# EAGLE design OMAPProc (EAGLE 6.2)
AUTHOR: Ryan Julian (ryanjulian@berkeley.edu); DESIGN_NAME: OMAPProc; REVISION: B; YEAR: 2012

## Sheet 1 of 3: Torpedo SOM
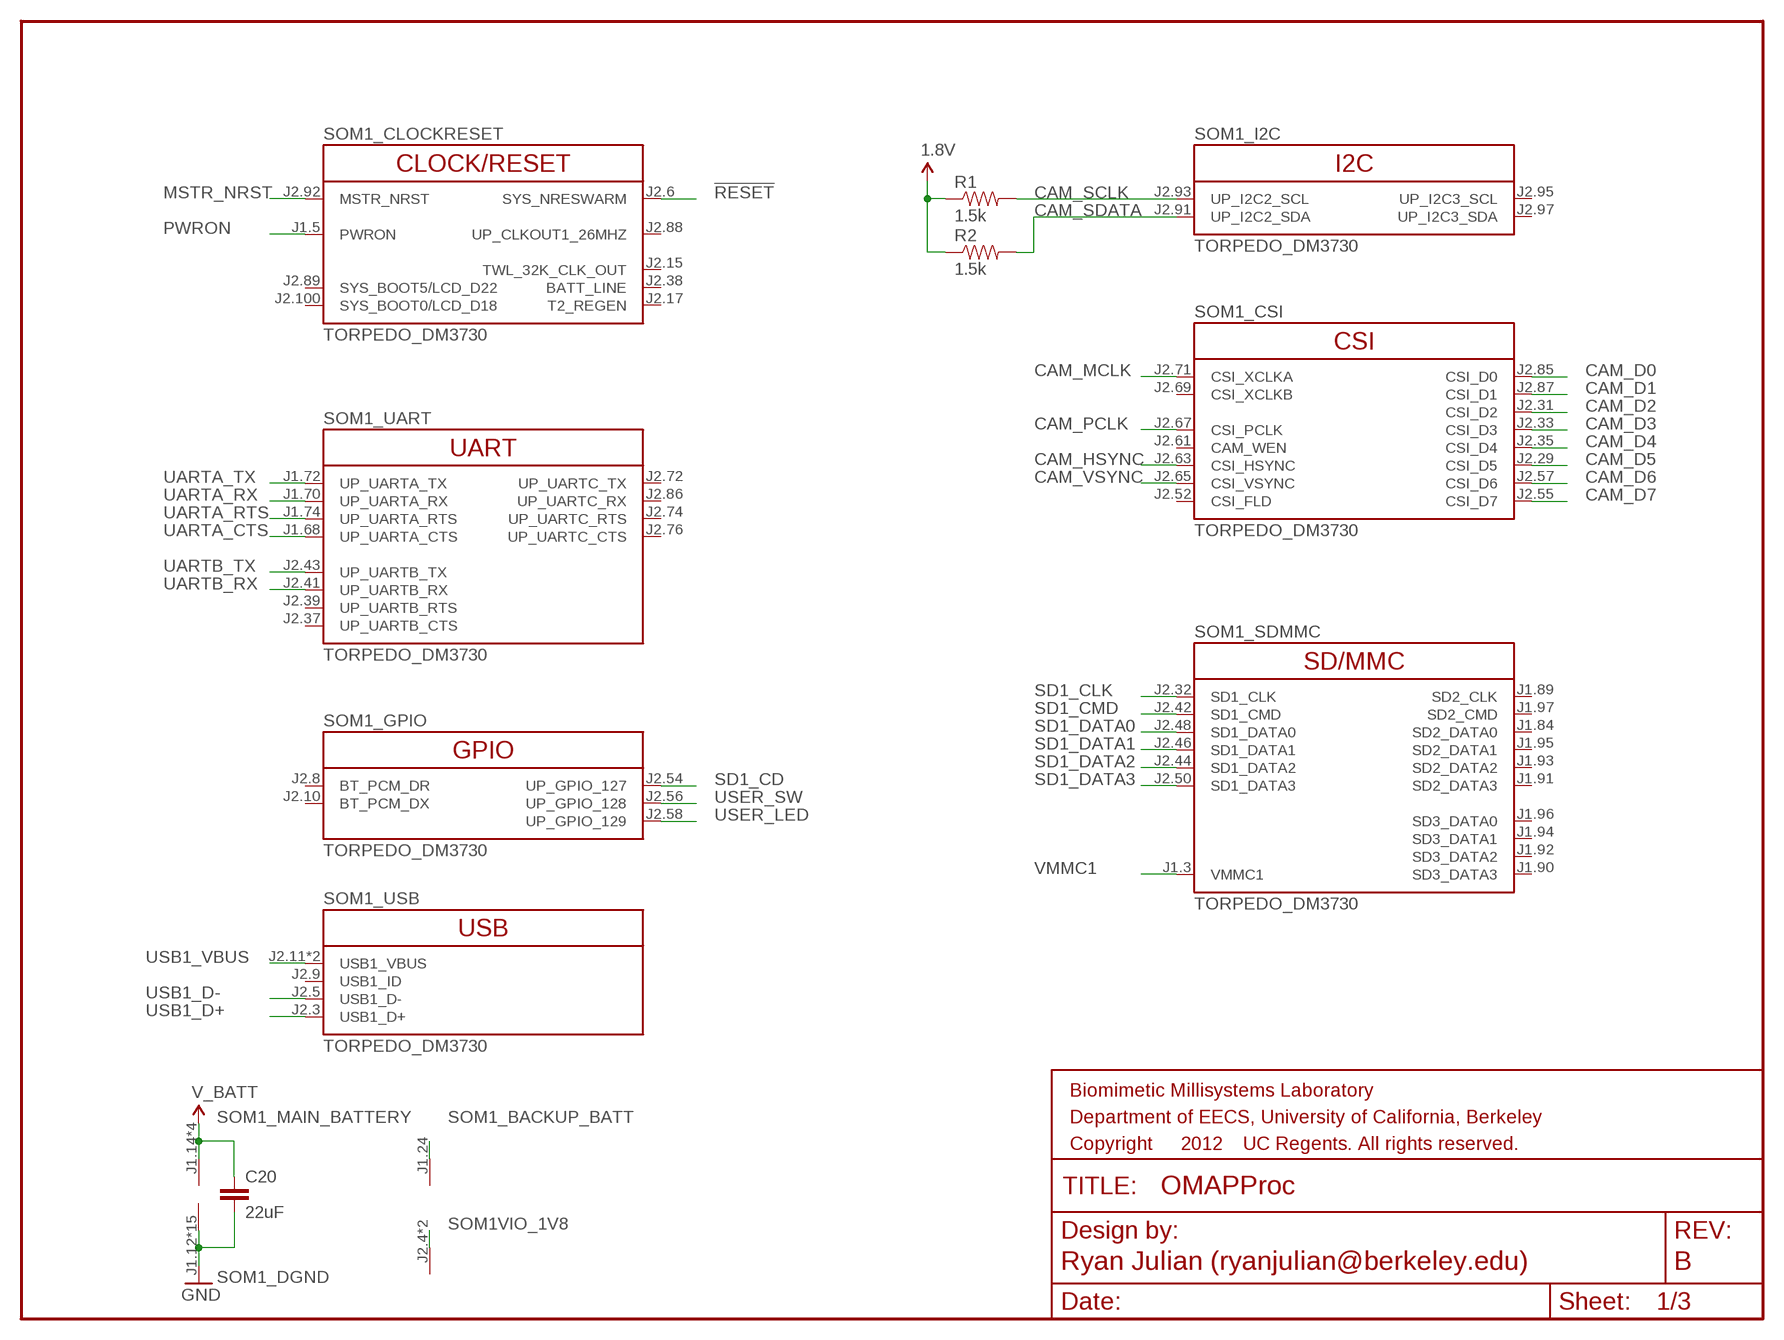
[diagram p0: schematic, sheet 1]
FRAME1 (FRAME-LETTER): SHEET_NAME: Torpedo SOM

### Parts
C20  22uF  CAP0603-CAP  [0603-CAP]
R1  1.5k  RESISTOR0402-RES  [0402-RES]
R2  1.5k  RESISTOR0402-RES  [0402-RES]
SOM1  TORPEDO_DM3730  [TORPEDO_DM3730]

### Nets
1.8V: R1.1 R2.1 ; also sheet 2,3
!RESET: SOM1.J2.6(_CLOCKRESET:SYS_NRESWARM) ; also sheet 2
CAM_D0: SOM1.J2.85(_CSI:CSI_D0) ; also sheet 2
CAM_D1: SOM1.J2.87(_CSI:CSI_D1) ; also sheet 2
CAM_D2: SOM1.J2.31(_CSI:CSI_D2) ; also sheet 2
CAM_D3: SOM1.J2.33(_CSI:CSI_D3) ; also sheet 2
CAM_D4: SOM1.J2.35(_CSI:CSI_D4) ; also sheet 2
CAM_D5: SOM1.J2.29(_CSI:CSI_D5) ; also sheet 2
CAM_D6: SOM1.J2.57(_CSI:CSI_D6) ; also sheet 2
CAM_D7: SOM1.J2.55(_CSI:CSI_D7) ; also sheet 2
CAM_HSYNC: SOM1.J2.63(_CSI:CSI_HSYNC) ; also sheet 2
CAM_MCLK: SOM1.J2.71(_CSI:CSI_XCLKA) ; also sheet 2
CAM_PCLK: SOM1.J2.67(_CSI:CSI_PCLK) ; also sheet 2
CAM_SCLK: R1.2 SOM1.J2.93(_I2C:UP_I2C2_SCL) ; also sheet 2
CAM_SDATA: R2.2 SOM1.J2.91(_I2C:UP_I2C2_SDA) ; also sheet 2
CAM_VSYNC: SOM1.J2.65(_CSI:CSI_VSYNC) ; also sheet 2
GND: C20.2 SOM1.J1.12(_DGND:V-) SOM1.J1.17(_DGND:V-) SOM1.J1.22(_DGND:V-) SOM1.J1.27(_DGND:V-) SOM1.J1.61(_DGND:V-) SOM1.J1.85(_DGND:V-) SOM1.J1.100(_DGND:V-) SOM1.J2.1(_DGND:V-) SOM1.J2.2(_DGND:V-) SOM1.J2.27(_DGND:V-) SOM1.J2.30(_DGND:V-) SOM1.J2.59(_DGND:V-) SOM1.J2.62(_DGND:V-) SOM1.J2.90(_DGND:V-) SOM1.J2.99(_DGND:V-) ; also sheet 2,3
MSTR_NRST: SOM1.J2.92(_CLOCKRESET:MSTR_NRST) ; also sheet 3
N$1: SOM1.J1.24(_BACKUP_BATT:V+)
N$2: SOM1.J2.4(VIO_1V8:V+) SOM1.J2.7(VIO_1V8:V+)
PWRON: SOM1.J1.5(_CLOCKRESET:PWRON) ; also sheet 3
SD1_CD: SOM1.J2.54(_GPIO:UP_GPIO_127) ; also sheet 3
SD1_CLK: SOM1.J2.32(_SDMMC:SD1_CLK) ; also sheet 3
SD1_CMD: SOM1.J2.42(_SDMMC:SD1_CMD) ; also sheet 3
SD1_DATA0: SOM1.J2.48(_SDMMC:SD1_DATA0) ; also sheet 3
SD1_DATA1: SOM1.J2.46(_SDMMC:SD1_DATA1) ; also sheet 3
SD1_DATA2: SOM1.J2.44(_SDMMC:SD1_DATA2) ; also sheet 3
SD1_DATA3: SOM1.J2.50(_SDMMC:SD1_DATA3) ; also sheet 3
UARTA_CTS: SOM1.J1.68(_UART:UP_UARTA_CTS) ; also sheet 3
UARTA_RTS: SOM1.J1.74(_UART:UP_UARTA_RTS) ; also sheet 3
UARTA_RX: SOM1.J1.70(_UART:UP_UARTA_RX) ; also sheet 3
UARTA_TX: SOM1.J1.72(_UART:UP_UARTA_TX) ; also sheet 3
UARTB_RX: SOM1.J2.41(_UART:UP_UARTB_RX) ; also sheet 3
UARTB_TX: SOM1.J2.43(_UART:UP_UARTB_TX) ; also sheet 3
USB1_D+: SOM1.J2.3(_USB:USB1_D+) ; also sheet 2
USB1_D-: SOM1.J2.5(_USB:USB1_D-) ; also sheet 2
USB1_VBUS: SOM1.J2.11(_USB:USB1_VBUS) SOM1.J2.13(_USB:USB1_VBUS) ; also sheet 2
USER_LED: SOM1.J2.58(_GPIO:UP_GPIO_129) ; also sheet 3
USER_SW: SOM1.J2.56(_GPIO:UP_GPIO_128) ; also sheet 3
V_BATT: C20.1 SOM1.J1.14(_MAIN_BATTERY:V+) SOM1.J1.16(_MAIN_BATTERY:V+) SOM1.J1.18(_MAIN_BATTERY:V+) SOM1.J1.20(_MAIN_BATTERY:V+) ; also sheet 3
VMMC1: SOM1.J1.3(_SDMMC:VMMC1) ; also sheet 3
Unconnected: SOM1.J1.1(_GPMC:UP_NWE) SOM1.J1.2(_AUDIO:CODEC_OUTL) SOM1.J1.4(_AUDIO:CODEC_INR) SOM1.J1.6(_AUDIO:CODEC_INL) SOM1.J1.7(_GPMC:UP_A9) SOM1.J1.8(_AUDIO:MIC_IN) SOM1.J1.9(_GPMC:UP_NCS0) SOM1.J1.10(_AUDIO:CODEC_OUTR) SOM1.J1.11(_GPMC:UP_NCS1) SOM1.J1.13(_GPMC:UP_A8) SOM1.J1.15(_GPMC:UP_NOE) SOM1.J1.19(_GPMC:UP_BUS_CLK) SOM1.J1.21(_GPMC:UP_NBE1) SOM1.J1.23(_GPMC:UP_NADV_ALE) SOM1.J1.25(_GPMC:UP_NBE0) SOM1.J1.26(_GPMC:UP_NWAIT) SOM1.J1.28(_GPMC:UP_NCS6) SOM1.J1.29(_GPMC:UP_D8) SOM1.J1.30(_GPMC:UP_DREQ0) SOM1.J1.31(_GPMC:UP_D9) SOM1.J1.32(_GPMC:UP_NCS5) SOM1.J1.33(_GPMC:UP_D2) SOM1.J1.34(_GPMC:UP_NCS4) SOM1.J1.35(_GPMC:UP_D0) SOM1.J1.36(_GPMC:UP_NCS3) SOM1.J1.37(_GPMC:UP_D1) SOM1.J1.38(_GPMC:UP_A10) SOM1.J1.39(_GPMC:UP_D3) SOM1.J1.40(_GPMC:UP_NCS2) SOM1.J1.41(_GPMC:UP_D12) SOM1.J1.42(_GPMC:UP_A4) SOM1.J1.43(_GPMC:UP_D10) SOM1.J1.44(_GPMC:UP_A3) SOM1.J1.45(_GPMC:UP_D11) SOM1.J1.46(_GPMC:UP_A2) SOM1.J1.47(_GPMC:UP_D13) SOM1.J1.48(_GPMC:UP_A1) SOM1.J1.49(_GPMC:UP_D4) SOM1.J1.50(_GPMC:UP_A7) SOM1.J1.51(_MCSPI:MCSPI2_CS1) SOM1.J1.52(_GPMC:UP_A6) SOM1.J1.53(_GPMC:UP_D6) SOM1.J1.54(_GPMC:UP_A5) SOM1.J1.55(_GPMC:UP_D7) SOM1.J1.56(_MCSPI:MCSPI2_SOMI) SOM1.J1.57(_GPMC:UP_D5) SOM1.J1.58(_MCSPI:MCSPI2_CS0) SOM1.J1.59(_GPMC:UP_D14) SOM1.J1.60(_MCSPI:MCSPI1_SOMI) SOM1.J1.62(_MCBSP:MCBSP4_DR) SOM1.J1.63(_GPMC:UP_D15) SOM1.J1.64(_MCSPI:MCSPI1_CLK) SOM1.J1.65(_MCSPI:MCSPI2_SIMO) SOM1.J1.66(_MCSPI:MCSPI1_SIMO) SOM1.J1.67(_MCSPI:MCSPI2_CLK) SOM1.J1.69(_MCSPI:MCSPI1_CS1) SOM1.J1.71(_MCSPI:MCSPI1_CS0) SOM1.J1.73(_LCDTV:LCD_PANEL_PWR) SOM1.J1.75(_LCDTV:LCD_BACKLIGHT_PWR) SOM1.J1.76(_ADC:ADCIN0) SOM1.J1.77(_MCBSP:MCBSP3_DR) SOM1.J1.78(_ADC:ADCIN1) SOM1.J1.79(_MCBSP:MCBSP3_DX) SOM1.J1.80(_ADC:ADCIN2) SOM1.J1.81(_MCBSP:MCBSP3_FSX) SOM1.J1.82(_ADC:ADCIN3) SOM1.J1.83(_MCBSP:MCBSP3_CLKX) SOM1.J1.84(_SDMMC:SD2_DATA0) SOM1.J1.86(_LCDTV:LCD_D17) SOM1.J1.87(_LCDTV:LCD_D23/SYS_BOOT6) SOM1.J1.88(_MCSPI:MCSPI3_CLK) SOM1.J1.89(_SDMMC:SD2_CLK) SOM1.J1.90(_SDMMC:SD3_DATA3) SOM1.J1.91(_SDMMC:SD2_DATA3) SOM1.J1.92(_SDMMC:SD3_DATA2) SOM1.J1.93(_SDMMC:SD2_DATA2) SOM1.J1.94(_SDMMC:SD3_DATA1) SOM1.J1.95(_SDMMC:SD2_DATA1) SOM1.J1.96(_SDMMC:SD3_DATA0) SOM1.J1.97(_SDMMC:SD2_CMD) SOM1.J1.98(_GPMC:UP_IODIR) SOM1.J1.99(_LCDTV:LCD_D16) SOM1.J2.8(_GPIO:BT_PCM_DR) SOM1.J2.9(_USB:USB1_ID) SOM1.J2.10(_GPIO:BT_PCM_DX) SOM1.J2.12(_LCDTV:LCD_HSYNC) SOM1.J2.14(_LCDTV:LCD_VSYNC) SOM1.J2.15(_CLOCKRESET:TWL_32K_CLK_OUT) SOM1.J2.16(_LCDTV:LCD_MDISP) SOM1.J2.17(_CLOCKRESET:T2_REGEN) SOM1.J2.18(_LCDTV:LCD_D6/G1) SOM1.J2.20(_LCDTV:LCD_D20/SYS_BOOT3) SOM1.J2.22(_LCDTV:LCD_D9/G4) SOM1.J2.24(_LCDTV:LCD_D8/G3) SOM1.J2.26(_LCDTV:LCD_D7/G2) SOM1.J2.28(_LCDTV:LCD_DCLK) SOM1.J2.34(_LCDTV:LCD_D19/SYS_BOOT1) SOM1.J2.36(_LCDTV:LCD_D18/SYS_BOOT0) SOM1.J2.37(_UART:UP_UARTB_CTS) SOM1.J2.38(_CLOCKRESET:BATT_LINE) SOM1.J2.39(_UART:UP_UARTB_RTS) SOM1.J2.40(_LCDTV:LCD_D21/SYS_BOOT4) SOM1.J2.45(_MCSPI:MCSPI4_CS0) SOM1.J2.47(_MCBSP:MCBSP2_DX) SOM1.J2.49(_MCBSP:MCBSP2_CLKX) SOM1.J2.51(_MCBSP:MCBSP2_FSX) SOM1.J2.52(_CSI:CSI_FLD) SOM1.J2.53(_MCBSP:MCBSP2_DR) SOM1.J2.60(_LCDTV:TV_OUT2) SOM1.J2.61(_CSI:CAM_WEN) SOM1.J2.64(_LCDTV:TV_OUT1) SOM1.J2.66(_LCDTV:LCD_D14/R4) SOM1.J2.68(_LCDTV:LCD_D13/R3) SOM1.J2.69(_CSI:CSI_XCLKB) SOM1.J2.70(_LCDTV:LCD_D12/R2) SOM1.J2.72(_UART:UP_UARTC_TX) SOM1.J2.73(_MCSPI:MCSPI4_SOMI) SOM1.J2.74(_UART:UP_UARTC_RTS) SOM1.J2.75(_MCSPI:MCSPI4_SIMO) SOM1.J2.76(_UART:UP_UARTC_CTS) SOM1.J2.77(_MCSPI:MCSPI4_CLK) SOM1.J2.78(_LCDTV:LCD_D15/R5) SOM1.J2.79(_LCDTV:LCD_D2/B3) SOM1.J2.80(_LCDTV:LCD_D22/SYS_BOOT5) SOM1.J2.81(_LCDTV:LCD_D3/B4) SOM1.J2.82(_LCDTV:LCD_D10/G5) SOM1.J2.83(_LCDTV:LCD_D1/B2) SOM1.J2.84(_LCDTV:LCD_D11/R1) SOM1.J2.86(_UART:UP_UARTC_RX) SOM1.J2.88(_CLOCKRESET:UP_CLKOUT1_26MHZ) SOM1.J2.89(_CLOCKRESET:SYS_BOOT5/LCD_D22) SOM1.J2.94(_LCDTV:LCD_D4/B5) SOM1.J2.95(_I2C:UP_I2C3_SCL) SOM1.J2.96(_LCDTV:LCD_D5/G0) SOM1.J2.97(_I2C:UP_I2C3_SDA) SOM1.J2.98(_LCDTV:LCD_D0/B1) SOM1.J2.100(_CLOCKRESET:SYS_BOOT0/LCD_D18)

## Sheet 2 of 3: Cameras
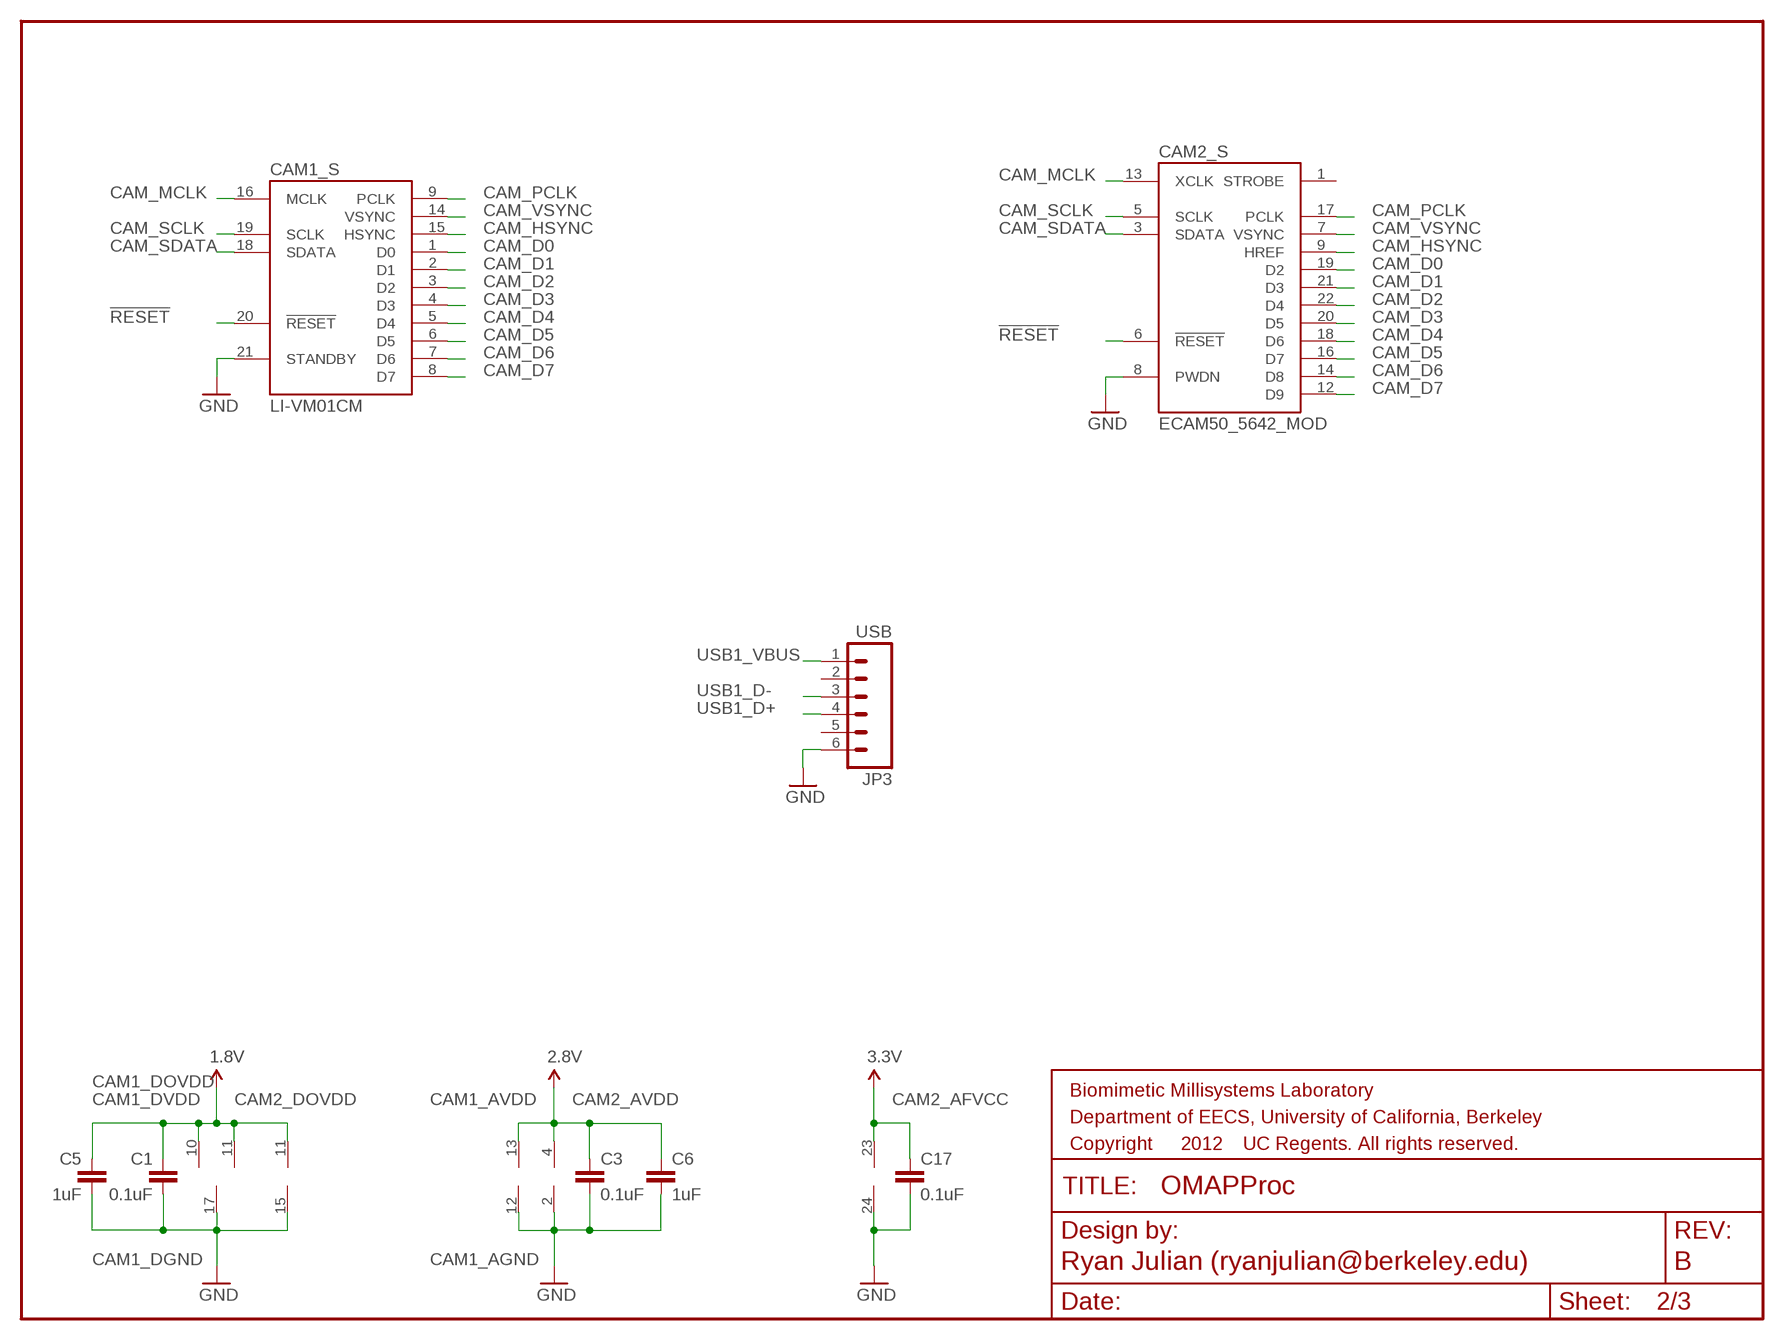
[diagram p1: schematic, sheet 2]
FRAME2 (FRAME-LETTER): SHEET_NAME: Cameras

### Parts
C1  0.1uF  CAP0402-CAP  [0402-CAP]
C3  0.1uF  CAP0402-CAP  [0402-CAP]
C5  1uF  CAP0402-CAP  [0402-CAP]
C6  1uF  CAP0402-CAP  [0402-CAP]
C17  0.1uF  CAP0402-CAP  [0402-CAP]
CAM1  LI-VM01CM  [AXK7L28227G]
CAM2  ECAM50_5642_MOD  [XF2W-2415-1A]
JP3  USB  MOLEX_503480-0600  [MOLEX_503480-0600]

### Nets
1.8V: C1.2 C5.2 CAM1.10(_DVDD:V+) CAM1.11(_DOVDD:V+) CAM2.11(_DOVDD:V+) ; also sheet 1,3
2.8V: C3.1 C6.1 CAM1.13(_AVDD:V+) CAM2.4(_AVDD:V+) ; also sheet 3
3.3V: C17.1 CAM2.23(_AFVCC:V+) ; also sheet 3
!RESET: CAM1.20(_S:!RESET) CAM2.6(_S:!RESET) ; also sheet 1
CAM_D0: CAM1.1(_S:D0) CAM2.19(_S:D2) ; also sheet 1
CAM_D1: CAM1.2(_S:D1) CAM2.21(_S:D3) ; also sheet 1
CAM_D2: CAM1.3(_S:D2) CAM2.22(_S:D4) ; also sheet 1
CAM_D3: CAM1.4(_S:D3) CAM2.20(_S:D5) ; also sheet 1
CAM_D4: CAM1.5(_S:D4) CAM2.18(_S:D6) ; also sheet 1
CAM_D5: CAM1.6(_S:D5) CAM2.16(_S:D7) ; also sheet 1
CAM_D6: CAM1.7(_S:D6) CAM2.14(_S:D8) ; also sheet 1
CAM_D7: CAM1.8(_S:D7) CAM2.12(_S:D9) ; also sheet 1
CAM_HSYNC: CAM1.15(_S:HSYNC) CAM2.9(_S:HREF) ; also sheet 1
CAM_MCLK: CAM1.16(_S:MCLK) CAM2.13(_S:XCLK) ; also sheet 1
CAM_PCLK: CAM1.9(_S:PCLK) CAM2.17(_S:PCLK) ; also sheet 1
CAM_SCLK: CAM1.19(_S:SCLK) CAM2.5(_S:SCLK) ; also sheet 1
CAM_SDATA: CAM1.18(_S:SDATA) CAM2.3(_S:SDATA) ; also sheet 1
CAM_VSYNC: CAM1.14(_S:VSYNC) CAM2.7(_S:VSYNC) ; also sheet 1
GND: C1.1 C3.2 C5.1 C6.2 C17.2 CAM1.12(_AGND:V-) CAM1.17(_DGND:V-) CAM1.21(_S:STANDBY) CAM2.2(_AVDD:V-) CAM2.8(_S:PWDN) CAM2.15(_DOVDD:V-) CAM2.24(_AFVCC:V-) JP3.6 ; also sheet 1,3
USB1_D+: JP3.4 ; also sheet 1
USB1_D-: JP3.3 ; also sheet 1
USB1_VBUS: JP3.1 ; also sheet 1
Unconnected: CAM2.1(_S:STROBE) JP3.2 JP3.5

## Sheet 3 of 3: Connectors and Power
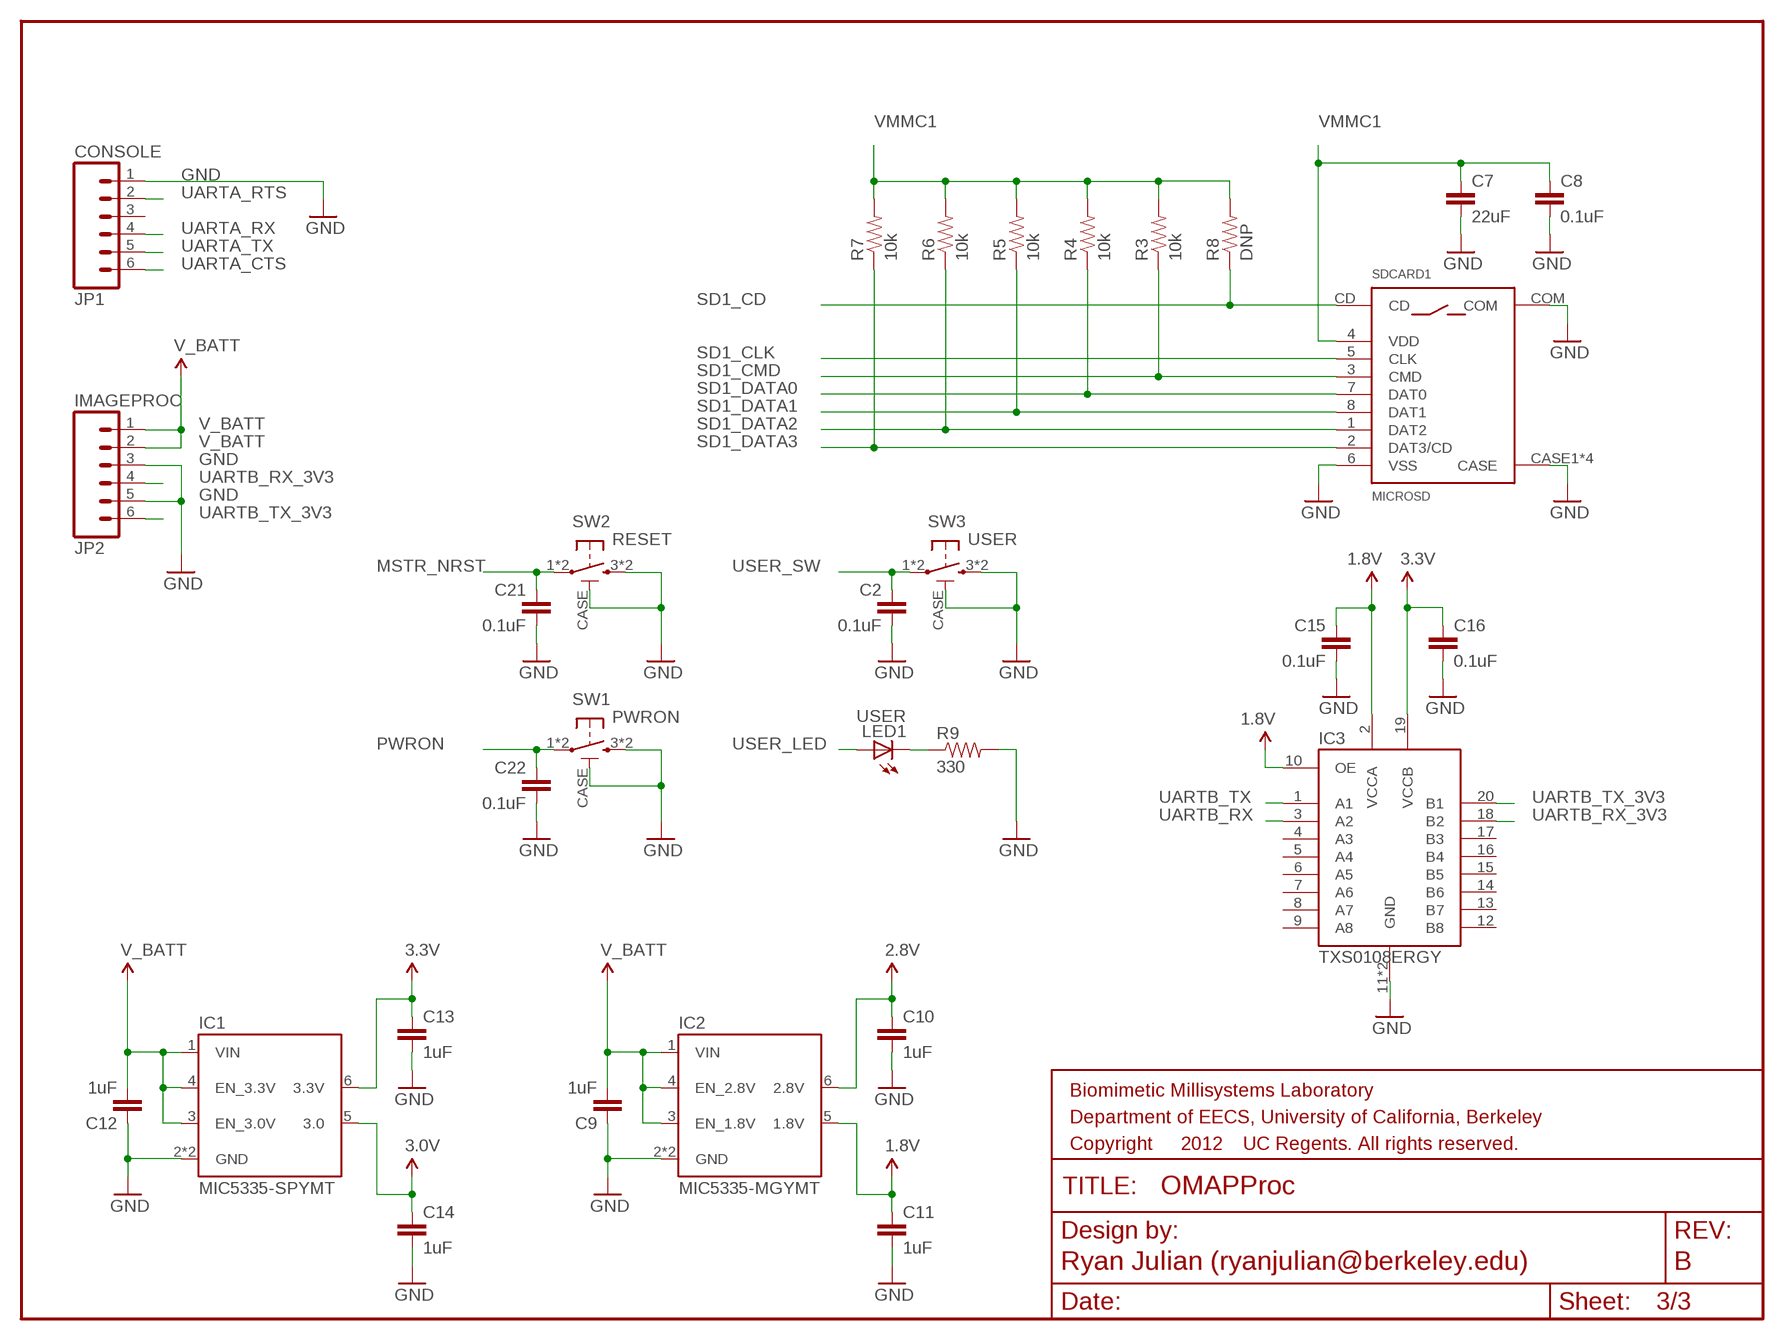
[diagram p2: schematic, sheet 3]
FRAME3 (FRAME-LETTER): SHEET_NAME: Connectors and Power

### Parts
C2  0.1uF  CAP0402-CAP  [0402-CAP]
C7  22uF  CAP0603-CAP  [0603-CAP]
C8  0.1uF  CAP0402-CAP  [0402-CAP]
C9  1uF  CAP0402-CAP  [0402-CAP]
C10  1uF  CAP0402-CAP  [0402-CAP]
C11  1uF  CAP0402-CAP  [0402-CAP]
C12  1uF  CAP0402-CAP  [0402-CAP]
C13  1uF  CAP0402-CAP  [0402-CAP]
C14  1uF  CAP0402-CAP  [0402-CAP]
C15  0.1uF  CAP0402-CAP  [0402-CAP]
C16  0.1uF  CAP0402-CAP  [0402-CAP]
C21  0.1uF  CAP0402-CAP  [0402-CAP]
C22  0.1uF  CAP0402-CAP  [0402-CAP]
IC1  MIC5335-SPYMT  [MLF-6]
IC2  MIC5335-MGYMT  [MLF-6]
IC3  TXS0108ERGY  [R-PVQFN-N20]
JP1  CONSOLE  MOLEX_503480-0600  [MOLEX_503480-0600]
JP2  IMAGEPROC  MOLEX_503480-0600  [MOLEX_503480-0600]
LED1  USER  LED0603  [LED-0603]
R3  10k  RESISTOR0402-RES  [0402-RES]
R4  10k  RESISTOR0402-RES  [0402-RES]
R5  10k  RESISTOR0402-RES  [0402-RES]
R6  10k  RESISTOR0402-RES  [0402-RES]
R7  10k  RESISTOR0402-RES  [0402-RES]
R8  DNP  RESISTOR0402-RES  [0402-RES]
R9  330  RESISTOR0402-RES  [0402-RES]
SDCARD1  MICROSD  [AVX_045138008010890+]
SW1  PWRON  KMR421GLFS  [KMR421G]
SW2  RESET  KMR421GLFS  [KMR421G]
SW3  USER  KMR421GLFS  [KMR421G]

### Nets
1.8V: C11.1 C15.1 IC2.5(1.8V) IC3.2(VCCA) IC3.10(OE) ; also sheet 1,2
2.8V: C10.1 IC2.6(2.8V) ; also sheet 2
3.0V: C14.1 IC1.5(3.0)
3.3V: C13.1 C16.1 IC1.6(3.3V) IC3.19(VCCB) ; also sheet 2
GND: C2.2 C7.2 C8.2 C9.1 C10.2 C11.2 C12.1 C13.2 C14.2 C15.2 C16.2 C21.2 C22.2 IC1.2(GND) IC1.EPAD(GND) IC2.2(GND) IC2.EPAD(GND) IC3.11(GND) IC3.EPAD(GND) JP1.1 JP2.3 JP2.5 R9.2 SDCARD1.6(VSS) SDCARD1.CASE1(CASE) SDCARD1.CASE2(CASE) SDCARD1.CASE3(CASE) SDCARD1.CASE4(CASE) SDCARD1.COM SW1.3(S) SW1.4(S) SW1.CASE SW2.3(S) SW2.4(S) SW2.CASE SW3.3(S) SW3.4(S) SW3.CASE ; also sheet 1,2
MSTR_NRST: C21.1 SW2.1(P) SW2.2(P) ; also sheet 1
N$3: LED1.C R9.1
PWRON: C22.1 SW1.1(P) SW1.2(P) ; also sheet 1
SD1_CD: R8.1 SDCARD1.CD ; also sheet 1
SD1_CLK: SDCARD1.5(CLK) ; also sheet 1
SD1_CMD: R3.1 SDCARD1.3(CMD) ; also sheet 1
SD1_DATA0: R4.1 SDCARD1.7(DAT0) ; also sheet 1
SD1_DATA1: R5.1 SDCARD1.8(DAT1) ; also sheet 1
SD1_DATA2: R6.1 SDCARD1.1(DAT2) ; also sheet 1
SD1_DATA3: R7.1 SDCARD1.2(DAT3/CD) ; also sheet 1
UARTA_CTS: JP1.6 ; also sheet 1
UARTA_RTS: JP1.2 ; also sheet 1
UARTA_RX: JP1.4 ; also sheet 1
UARTA_TX: JP1.5 ; also sheet 1
UARTB_RX: IC3.3(A2) ; also sheet 1
UARTB_RX_3V3: IC3.18(B2) JP2.4
UARTB_TX: IC3.1(A1) ; also sheet 1
UARTB_TX_3V3: IC3.20(B1) JP2.6
USER_LED: LED1.A ; also sheet 1
USER_SW: C2.1 SW3.1(P) SW3.2(P) ; also sheet 1
V_BATT: C9.2 C12.2 IC1.1(VIN) IC1.3(EN_3.0V) IC1.4(EN_3.3V) IC2.1(VIN) IC2.3(EN_1.8V) IC2.4(EN_2.8V) JP2.1 JP2.2 ; also sheet 1
VMMC1: C7.1 C8.1 R3.2 R4.2 R5.2 R6.2 R7.2 R8.2 SDCARD1.4(VDD) ; also sheet 1
Unconnected: IC3.4(A3) IC3.5(A4) IC3.6(A5) IC3.7(A6) IC3.8(A7) IC3.9(A8) IC3.12(B8) IC3.13(B7) IC3.14(B6) IC3.15(B5) IC3.16(B4) IC3.17(B3) JP1.3

## Library data of the parts
C1-C3 C5-C17 C20-C22 = biomimetic:CAP: Capacitor Standard 0603 ceramic capacitor, and 0.1" leaded capacitor.
CAM1 = biomimetic:LI-VM01CM: VGA camera module for OMAP Backpack Digi-Key P/N refers to the appropriate mating connector; DIGIKEY: 255-3150-1-ND
CAM2 = biomimetic:ECAM50_5642_MOD: e-con Systems 5MP AF camera module Digi-Key P/N is for the appropriate mating connector.; DIGIKEY: OR877CT-ND
IC1 = biomimetic:MIC5335-SPYMT: Micrel MIC5335 150mA dual (3.3V/3.0V) voltage regulator.; DIGIKEY: 576-1949-1-ND
IC2 = biomimetic:MIC5335-MGYMT: Micrel MIC5335 150mA dual (2.8V/1.8V) voltage regulator.; DIGIKEY: 576-3670-1-ND
IC3 = biomimetic:TXS0108E: 8-BIT BIDIRECTIONAL VOLTAGE-LEVEL TRANSLATOR FOR OPEN-DRAIN AND PUSH-PULL APPLICATIONS; DIGIKEY: 296-24806-1-ND
JP1-JP3 = biomimetic:MOLEX_503480-0600: Molex FPC connector, 6 pos.; DIGIKEY: WM1387CT-ND
LED1 = biomimetic:LED: LEDs Standard schematic elements and footprints for 5mm, 3mm, 1206, and 0603 sized LEDs. 5mm - Spark Fun Electronics SKU : COM-00529 (and others)
R1-R9 = biomimetic:RESISTOR: Resistor Basic schematic elements and footprints for 0603, 1206, and PTH resistors.
SDCARD1 = biomimetic:MICROSD: AVX 045138008010890+ microSD card connector; DIGIKEY: 478-4965-1-ND
SOM1 = biomimetic:TORPEDO_DM3730: LogicPD Torpeod DM3730 System-On-Module Mating connector HiRose DF40C-100DS-0.4V(51) Digi-Key P/N: H11615CT-ND; DIGIKEY: 460-3514-ND
SW1-SW3 = biomimetic:KMR421G: SWITCH TACTILE SPST-NO 0.05A 32V; DIGIKEY: CKN10249CT-ND

## Net classes
1 sup: width 0.254 mm

## Board
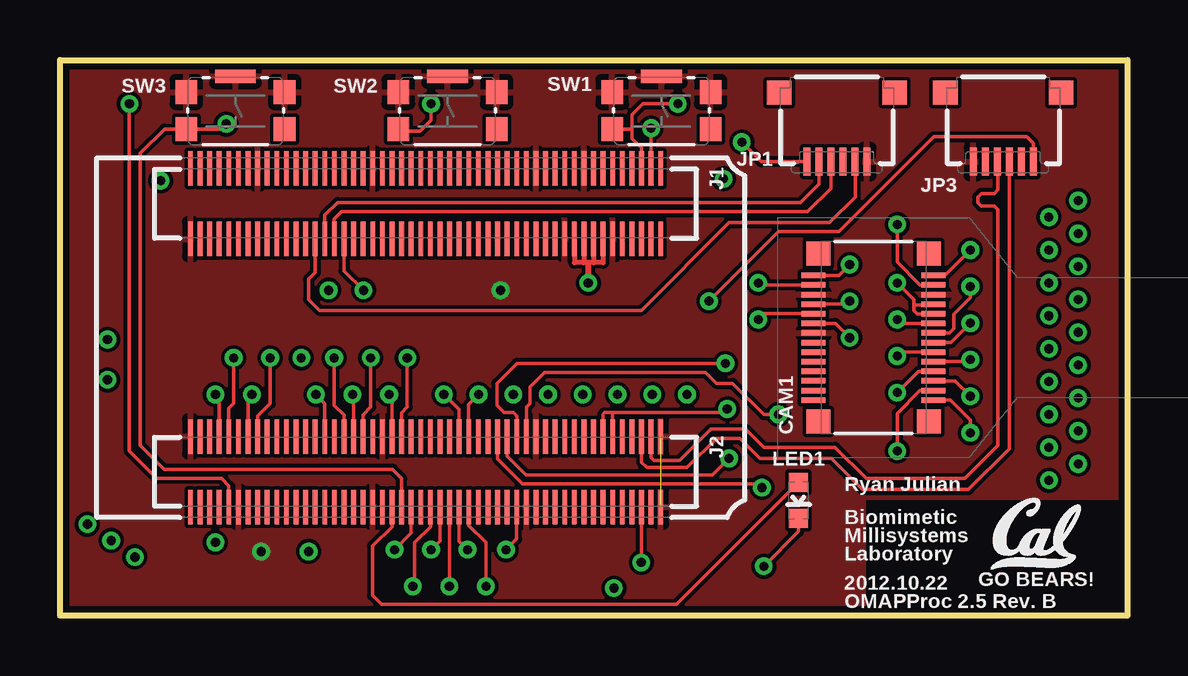
[diagram p3: board, top side]
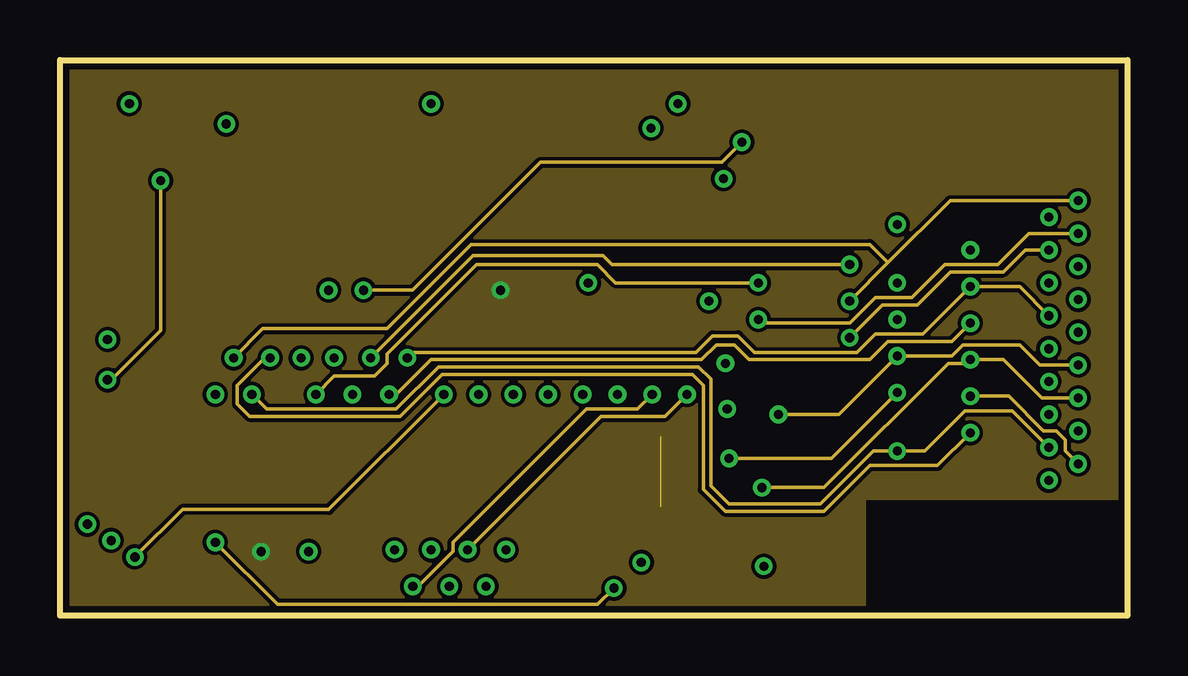
[diagram p4: board, inner layer Ground]
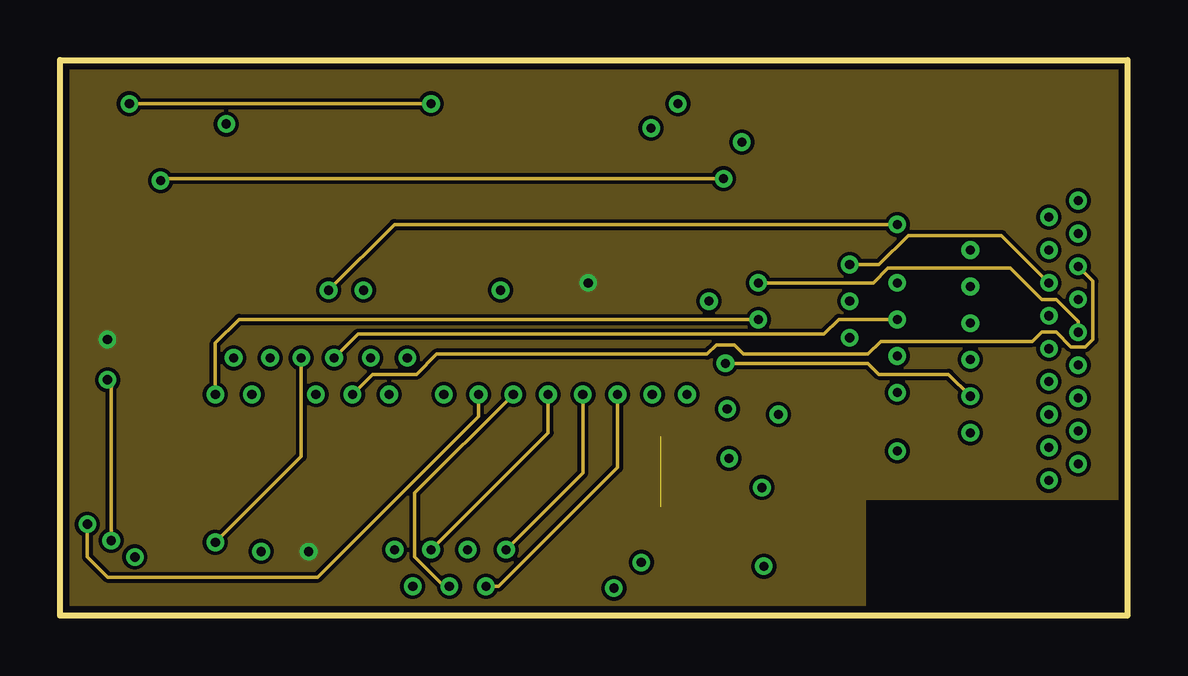
[diagram p5: board, inner layer Power]
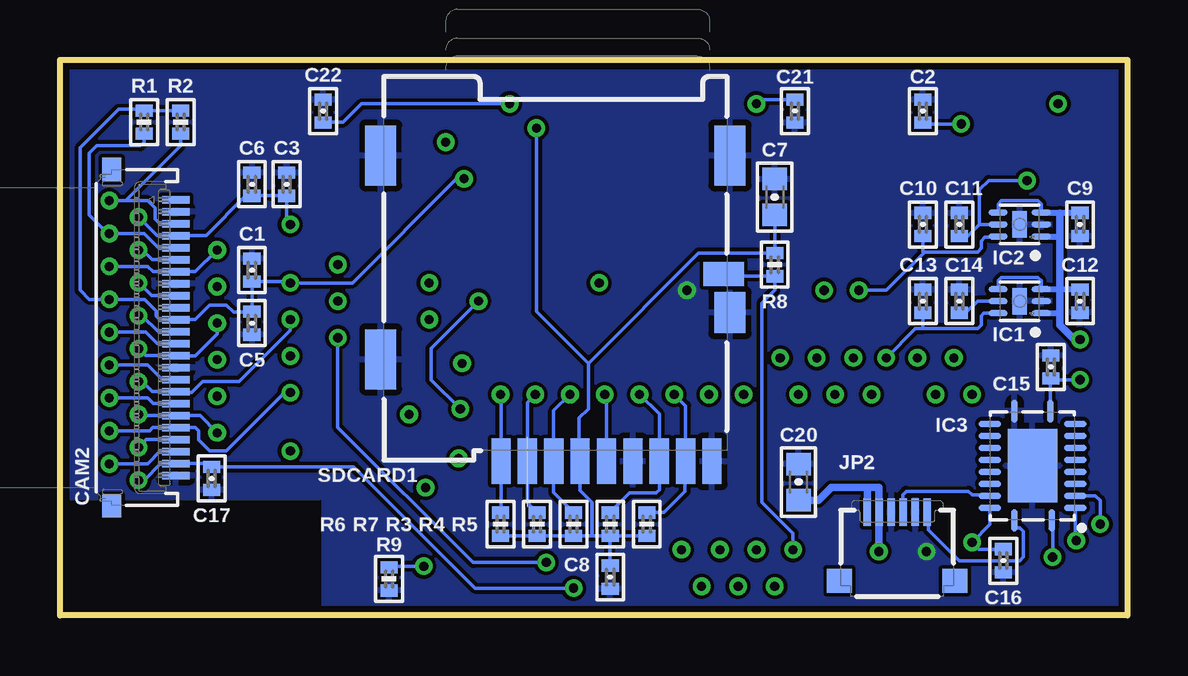
[diagram p6: board, bottom side, seen from below]

Size 44.5 x 23.17 mm. Coordinates in mm from the lower left corner, seen from the top.
Outline: 0,0.01 0,0
Outline: 0,0.01 0,23.18 44.5,23.18 44.5,0.01 0,0.01
Copper layers (1*2+3*16): Top 2mil / dielectric 9mil / Ground 2mil / dielectric 40mil / Power 2mil / dielectric 9mil / Bottom 2mil
Design rules: minimum track width 6mil, minimum drill 15mil, track to track 6mil, track to pad 6mil, pad to pad 6mil, via to via 6mil, smd to smd 6mil, copper to edge 10mil, drill to drill 7mil, minimum pad ring 7mil, minimum via ring 7mil, stop-mask expansion 3mil, vias tented up to drill 0mil, thermal gap 10mil
tKeepout: 4 lines
bKeepout: 4 lines

### Footprints (pad centres in the part's own frame; a part is rotated, then mirrored left to right if it is on the bottom)
0402-CAP = smd 0.508 x 0.711: 1 -0.483,0; 2 0.483,0
0603-CAP = smd 0.94 x 1.016: 1 -0.749,0; 2 0.749,0
AXK7L28227G = smd 0.23 x 1: 1 2.6,2.5; 2 2.2,2.5; 3 1.8,2.5; 4 1.4,2.5; 5 1,2.5; 6 0.6,2.5; 7 0.2,2.5; 8 -0.2,2.5; 9 -0.6,2.5; 10 -1,2.5; 11 -1.4,2.5; 12 -1.8,2.5; 13 -2.2,2.5; 14 -2.6,2.5; 15 -2.6,-2.5; 16 -2.2,-2.5; 17 -1.8,-2.5; 18 -1.4,-2.5; 19 -1,-2.5; 20 -0.6,-2.5; 21 -0.2,-2.5; 22 0.2,-2.5; 23 0.6,-2.5; 24 1,-2.5; 25 1.4,-2.5; 26 1.8,-2.5; 27 2.2,-2.5; 28 2.6,-2.5 | smd 1 x 1: M1 3.5,2.3; M14 -3.5,2.3; M15 -3.5,-2.3; M28 3.5,-2.3
XF2W-2415-1A = smd 0.3 x 1.15: 1 -5.75,1.625; 2 -5.25,1.625; 3 -4.75,1.625; 4 -4.25,1.625; 5 -3.75,1.625; 6 -3.25,1.625; 7 -2.75,1.625; 8 -2.25,1.625; 9 -1.75,1.625; 10 -1.25,1.625; 11 -0.75,1.625; 12 -0.25,1.625; 13 0.25,1.625; 14 0.75,1.625; 15 1.25,1.625; 16 1.75,1.625; 17 2.25,1.625; 18 2.75,1.625; 19 3.25,1.625; 20 3.75,1.625; 21 4.25,1.625; 22 4.75,1.625; 23 5.25,1.625; 24 5.75,1.625 | smd 0.95 x 0.8: L -7.025,-1.05; R 7.025,-1.05
MLF-6 = smd 0.25 x 0.8: 1 -0.5,-0.9; 2 0,-0.9; 3 0.5,-0.9; 4 0.5,0.9; 5 0,0.9; 6 -0.5,0.9 | smd 1.1 x 0.6: EPAD 0,0
R-PVQFN-N20 = smd 0.95 x 0.28: 1 -2.275,-0.8; 10 2.275,-0.75; 11 2.275,0.75; 20 -2.275,0.75 | smd 0.28 x 0.95: 2 -1.75,-1.775; 3 -1.25,-1.775; 4 -0.75,-1.775; 5 -0.25,-1.775; 6 0.25,-1.775; 7 0.75,-1.775; 8 1.25,-1.775; 9 1.75,-1.775; 12 1.75,1.775; 13 1.25,1.775; 14 0.75,1.775; 15 0.25,1.775; 16 -0.25,1.775; 17 -0.75,1.775; 18 -1.25,1.775; 19 -1.75,1.775 | smd 3.05 x 2.05: EPAD 0,0
MOLEX_503480-0600 = smd 0.3 x 1.15: 1 -1.25,1.725; 2 -0.75,1.725; 3 -0.25,1.725; 4 0.25,1.725; 5 0.75,1.725; 6 1.25,1.725 | smd 1.035 x 1: L -2.408,-1.15; R 2.408,-1.15
LED-0603 = smd 0.8 x 0.8: A 0,-0.75; C 0,0.75
0402-RES = smd 0.508 x 0.711: 1 -0.483,0; 2 0.483,0
AVX_045138008010890+ = smd 0.8 x 1.9: 1 -2.27,-8.05; 2 -1.17,-8.05; 3 -0.07,-8.05; 4 1.03,-8.05; 5 2.13,-8.05; 6 3.23,-8.05; 7 4.33,-8.05; 8 5.43,-8.05; COM 6.53,-8.05 | smd 1.3 x 2.5: CASE1 -7.28,-3.8; CASE2 -7.28,4.7; CASE3 7.28,4.7 | smd 1.3 x 1.7: CASE4 7.28,-1.85 | smd 1.7 x 1: CD 7.02,-0.25
TORPEDO_DM3730 = smd 0.2 x 1.44: J1.1 -9.8,-7.06; J1.2 -9.8,-4.12; J1.3 -9.4,-7.06; J1.4 -9.4,-4.12; J1.5 -9,-7.06; J1.6 -9,-4.12; J1.7 -8.6,-7.06; J1.8 -8.6,-4.12; J1.9 -8.2,-7.06; J1.10 -8.2,-4.12; J1.11 -7.8,-7.06; J1.12 -7.8,-4.12; J1.13 -7.4,-7.06; J1.14 -7.4,-4.12; J1.15 -7,-7.06; J1.16 -7,-4.12; J1.17 -6.6,-7.06; J1.18 -6.6,-4.12; J1.19 -6.2,-7.06; J1.20 -6.2,-4.12; J1.21 -5.8,-7.06; J1.22 -5.8,-4.12; J1.23 -5.4,-7.06; J1.24 -5.4,-4.12; J1.25 -5,-7.06; J1.26 -5,-4.12; J1.27 -4.6,-7.06; J1.28 -4.6,-4.12; J1.29 -4.2,-7.06; J1.30 -4.2,-4.12; J1.31 -3.8,-7.06; J1.32 -3.8,-4.12; J1.33 -3.4,-7.06; J1.34 -3.4,-4.12; J1.35 -3,-7.06; J1.36 -3,-4.12; J1.37 -2.6,-7.06; J1.38 -2.6,-4.12; J1.39 -2.2,-7.06; J1.40 -2.2,-4.12; J1.41 -1.8,-7.06; J1.42 -1.8,-4.12; J1.43 -1.4,-7.06; J1.44 -1.4,-4.12; J1.45 -1,-7.06; J1.46 -1,-4.12; J1.47 -0.6,-7.06; J1.48 -0.6,-4.12; J1.49 -0.2,-7.06; J1.50 -0.2,-4.12; J1.51 0.2,-7.06; J1.52 0.2,-4.12; J1.53 0.6,-7.06; J1.54 0.6,-4.12; J1.55 1,-7.06; J1.56 1,-4.12; J1.57 1.4,-7.06; J1.58 1.4,-4.12; J1.59 1.8,-7.06; J1.60 1.8,-4.12; J1.61 2.2,-7.06; J1.62 2.2,-4.12; J1.63 2.6,-7.06; J1.64 2.6,-4.12; J1.65 3,-7.06; J1.66 3,-4.12; J1.67 3.4,-7.06; J1.68 3.4,-4.12; J1.69 3.8,-7.06; J1.70 3.8,-4.12; J1.71 4.2,-7.06; J1.72 4.2,-4.12; J1.73 4.6,-7.06; J1.74 4.6,-4.12; J1.75 5,-7.06; J1.76 5,-4.12; J1.77 5.4,-7.06; J1.78 5.4,-4.12; J1.79 5.8,-7.06; J1.80 5.8,-4.12; J1.81 6.2,-7.06; J1.82 6.2,-4.12; J1.83 6.6,-7.06; J1.84 6.6,-4.12; J1.85 7,-7.06; J1.86 7,-4.12; J1.87 7.4,-7.06; J1.88 7.4,-4.12; J1.89 7.8,-7.06; J1.90 7.8,-4.12; J1.91 8.2,-7.06; J1.92 8.2,-4.12; J1.93 8.6,-7.06; J1.94 8.6,-4.12; J1.95 9,-7.06; J1.96 9,-4.12; J1.97 9.4,-7.06; J1.98 9.4,-4.12; J1.99 9.8,-7.06; J1.100 9.8,-4.12; J2.1 -9.8,4.12; J2.2 -9.8,7.06; J2.3 -9.4,4.12; J2.4 -9.4,7.06; J2.5 -9,4.12; J2.6 -9,7.06; J2.7 -8.6,4.12; J2.8 -8.6,7.06; J2.9 -8.2,4.12; J2.10 -8.2,7.06; J2.11 -7.8,4.12; J2.12 -7.8,7.06; J2.13 -7.4,4.12; J2.14 -7.4,7.06; J2.15 -7,4.12; J2.16 -7,7.06; J2.17 -6.6,4.12; J2.18 -6.6,7.06; J2.19 -6.2,4.12; J2.20 -6.2,7.06; J2.21 -5.8,4.12; J2.22 -5.8,7.06; J2.23 -5.4,4.12; J2.24 -5.4,7.06; J2.25 -5,4.12; J2.26 -5,7.06; J2.27 -4.6,4.12; J2.28 -4.6,7.06; J2.29 -4.2,4.12; J2.30 -4.2,7.06; J2.31 -3.8,4.12; J2.32 -3.8,7.06; J2.33 -3.4,4.12; J2.34 -3.4,7.06; J2.35 -3,4.12; J2.36 -3,7.06; J2.37 -2.6,4.12; J2.38 -2.6,7.06; J2.39 -2.2,4.12; J2.40 -2.2,7.06; J2.41 -1.8,4.12; J2.42 -1.8,7.06; J2.43 -1.4,4.12; J2.44 -1.4,7.06; J2.45 -1,4.12; J2.46 -1,7.06; J2.47 -0.6,4.12; J2.48 -0.6,7.06; J2.49 -0.2,4.12; J2.50 -0.2,7.06; J2.51 0.2,4.12; J2.52 0.2,7.06; J2.53 0.6,4.12; J2.54 0.6,7.06; J2.55 1,4.12; J2.56 1,7.06; J2.57 1.4,4.12; J2.58 1.4,7.06; J2.59 1.8,4.12; J2.60 1.8,7.06; J2.61 2.2,4.12; J2.62 2.2,7.06; J2.63 2.6,4.12; J2.64 2.6,7.06; J2.65 3,4.12; J2.66 3,7.06; J2.67 3.4,4.12; J2.68 3.4,7.06; J2.69 3.8,4.12; J2.70 3.8,7.06; J2.71 4.2,4.12; J2.72 4.2,7.06; J2.73 4.6,4.12; J2.74 4.6,7.06; J2.75 5,4.12; J2.76 5,7.06; J2.77 5.4,4.12; J2.78 5.4,7.06; J2.79 5.8,4.12; J2.80 5.8,7.06; J2.81 6.2,4.12; J2.82 6.2,7.06; J2.83 6.6,4.12; J2.84 6.6,7.06; J2.85 7,4.12; J2.86 7,7.06; J2.87 7.4,4.12; J2.88 7.4,7.06; J2.89 7.8,4.12; J2.90 7.8,7.06; J2.91 8.2,4.12; J2.92 8.2,7.06; J2.93 8.6,4.12; J2.94 8.6,7.06; J2.95 9,4.12; J2.96 9,7.06; J2.97 9.4,4.12; J2.98 9.4,7.06; J2.99 9.8,4.12; J2.100 9.8,7.06
KMR421G = smd 0.9 x 1: 1 2.05,-0.75; 2 -2.05,-0.75; 3 2.05,0.8; 4 -2.05,0.8 | smd 1.7 x 0.55: CASE 0,1.45

### Placement (x,y rotation side)
C1  36.5,14.41 270 bottom
C2  8.53,21.04 90 bottom
C3  35.05,17.99 90 bottom
C5  36.5,12.2 90 bottom
C6  36.5,17.99 90 bottom
C7  14.71,17.46 90 bottom
C8  21.56,1.61 270 bottom
C9  1.98,16.32 90 bottom
C10  8.53,16.32 90 bottom
C11  7.01,16.32 90 bottom
C12  1.98,13.12 90 bottom
C13  8.53,13.12 90 bottom
C14  7.01,13.12 90 bottom
C15  3.2,10.37 90 bottom
C16  5.18,2.3 270 bottom
C17  38.18,5.72 270 bottom
C20  13.72,5.57 90 bottom
C21  13.87,21.04 270 bottom
C22  33.53,21.04 90 bottom
CAM1  33.91,11.59 270 top
CAM2  41.3,11.59 270 bottom
IC1  4.5,13.12 90 bottom
IC2  4.5,16.32 90 bottom
IC3  3.96,6.25 90 bottom
JP1  32.38,20.66 180 top
JP2  9.6,2.6 0 bottom
JP3  39.32,20.66 180 top
LED1  30.78,4.81 180 top
R1  41,20.58 270 bottom
R2  39.47,20.58 270 bottom
R3  23.09,3.82 270 bottom
R4  21.56,3.82 270 bottom
R5  20.04,3.82 270 bottom
R6  26.14,3.82 270 bottom
R7  24.61,3.82 270 bottom
R8  14.71,14.64 90 bottom
R9  30.78,1.53 270 bottom
SDCARD1  23.85,14.49 0 bottom
SOM1  15.24,11.59 180 top
SW1  25.07,21.04 0 top
SW2  16.15,21.04 0 top
SW3  7.32,21.04 0 top
U$12  [CAL_LOGO]  38.79,1.92 0 top

### Tracks (layer width: path | path; a pad name or v marks a point on that pad's centre or on a via)
1.8V  (via drill 0.38)
  Top 0.152: CAM1.11 36.15,12.99 36.12,12.96 35.59,12.96 | v34.9,13.88 35.59,13.19 35.59,12.96 | 35.59,12.96 35.59,12.73 35.74,12.58 CAM1.10
  Ground 0.152: v4.19,18.15 4.19,11.9 2.13,9.84 v1.98,9.84
  Power 0.152: v2.13,3.13 2.13,9.69 v1.98,9.84 | v27.66,18.22 4.27,18.22 v4.19,18.15
  Bottom 0.152: 39.46,12.35 39.55,12.35 | 39.55,12.35 40.34,12.35 40.49,12.51 40.49,12.71 40.97,13.19 v42.44,13.19 43.28,13.19 43.66,13.57 43.66,19.52 42.06,21.12 41.05,21.12 R1.1 R2.1 | 39.55,12.35 39.56,12.34 CAM2.11 38.87,12.34 38.25,12.96 37.57,12.96 37.26,12.66 36.52,12.66 C5.2 C1.2 34.95,13.93 v34.9,13.88 32.31,13.88 27.96,18.22 v27.66,18.22 | IC3.10 C15.1 3.15,9.84 v1.98,9.84 | IC3.2 2.18,3.18 v2.13,3.13 | IC2.5 6.17,16.32 | 6.17,16.32 6.17,17.77 5.79,18.15 v4.19,18.15 | C11.1 6.66,15.83 6.17,16.32
2.8V  (via drill 0.38)
  Top 0.152: CAM1.13 35.85,13.79 34.9,14.74 v34.9,16.32
  Power 0.152: v11.2,13.57 13.95,16.32 v34.9,16.32
  Bottom 0.152: v41.22,16.62 40.45,15.84 CAM2.4 39.66,15.86 38.41,15.86 36.75,17.51 C6.1 C3.1 35.05,16.44 35.03,16.44 v34.9,16.32 | IC2.6 5.4,15.78 5.94,15.78 6.1,15.63 6.1,15.33 6.25,15.17 8.46,15.17 | 8.46,15.17 8.53,15.17 C10.1 | v11.2,13.57 10.06,13.57 8.46,15.17
3.0V
  Bottom 0.152: IC1.5 6.25,13.12 6.73,12.63 C14.1
3.3V  (via drill 0.38)
  Ground 0.152: v23.09,1.15 22.4,0.47 9.07,0.47 v6.48,3.06
  Power 0.152: v10.06,10.75 10.06,6.64 v6.48,3.06
  Bottom 0.152: v41.22,5.65 41,5.65 40.3,6.34 CAM2.23 38.31,6.34 C17.1 32.26,6.21 27.2,1.15 v23.09,1.15 | 5.73,4.18 IC3.19 5.73,3.8 v6.48,3.06 6.2,2.78 C16.1 | IC1.6 5.99,12.62 6.1,12.51 6.1,12.13 6.25,11.97 8.53,11.97 | 8.53,11.97 C13.1 | v10.06,10.75 8.84,11.97 8.53,11.97
!RESET  (via drill 0.38)
  Top 0.152: CAM1.20 32.32,12.19 v32.92,11.59 | v24.23,2.22 SOM1.J2.6
  Ground 0.152: v32.92,11.59 34.29,12.96 35.74,12.96 37.11,14.34 39.32,14.34 40.23,15.25 v41.22,15.25
  Bottom 0.152: CAM2.6 40.66,14.84 41.07,15.25 v41.22,15.25 | v24.23,2.22 27.28,2.22 32.92,7.86 v32.92,11.59
CAM_D0  (via drill 0.38)
  Top 0.152: CAM1.1 37.12,8.99 37.95,8.16 v37.95,7.63 | SOM1.J2.85 8.24,8.33 8.76,8.85 v8.76,10.75
  Ground 0.152: v8.76,10.75 8.53,10.75 7.39,9.61 7.39,8.82 7.9,8.32 14.17,8.32 15.93,10.07 26.36,10.07 26.82,9.61 26.82,5.27 27.74,4.35 31.85,4.35 33.76,6.26 36.58,6.26 v37.95,7.63
  Bottom 0.152: v41.22,8.39 41.17,8.34 CAM2.19 38.66,8.34 v37.95,7.63
CAM_D1  (via drill 0.38)
  Top 0.152: CAM1.2 35.85,9.39 34.9,8.44 v34.9,6.87 | SOM1.J2.87 7.84,9.07 v8,9.23
  Ground 0.152: v41.22,7.02 39.7,8.54 37.72,8.54 36.04,6.87 v34.9,6.87 33.91,6.87 31.7,4.66 27.89,4.66 27.13,5.42 27.13,9.87 26.62,10.37 15.77,10.37 14.02,8.62 8.61,8.62 v8,9.23
  Bottom 0.152: CAM2.21 40.9,7.34 v41.22,7.02
CAM_D2  (via drill 0.38)
  Top 0.152: CAM1.3 37.31,9.79 v37.95,9.15 | v27.74,10.53 19.05,10.53 18.21,9.69 18.21,8.77 18.52,8.47 18.9,8.47 19.05,8.32 19.05,7.48 SOM1.J2.31
  Ground 0.152: v37.95,9.15 39.55,9.15 41,7.71 41.53,7.71 41.91,7.33 41.91,6.87 v42.44,6.33
  Power 0.152: v27.74,10.53 33.68,10.53 34.14,10.07 37.03,10.07 v37.95,9.15
  Bottom 0.152: CAM2.22 40.34,6.84 40.84,6.33 v42.44,6.33
CAM_D3  (via drill 0.38)
  Top 0.152: CAM1.4 35.79,10.19 v34.9,9.31 | v27.89,6.56 27.2,5.88 19.43,5.88 18.64,6.67 SOM1.J2.33
  Ground 0.152: v27.89,6.56 32.16,6.56 v34.9,9.31
  Bottom 0.152: v42.44,7.71 40.77,7.71 40.63,7.84 CAM2.20 39.66,7.86 38.86,7.86 38.71,7.71 38.71,7.33 38.25,6.87 37.57,6.87 35.13,9.31 v34.9,9.31
CAM_D4  (via drill 0.38)
  Top 0.152: CAM1.5 37.86,10.59 v37.95,10.68 | v29.26,5.34 29.11,5.5 19.28,5.5 18.24,6.54 SOM1.J2.35
  Ground 0.152: v42.44,9.08 40.92,9.08 39.32,10.68 v37.95,10.68 37.8,10.53 37.03,10.53 31.85,5.34 v29.26,5.34
  Bottom 0.152: CAM2.18 40.61,8.84 40.84,9.08 v42.44,9.08
CAM_D5  (via drill 0.38)
  Top 0.152: CAM1.6 35.06,10.99 v34.9,10.83 | v29.95,8.39 29.34,8.39 28.04,9.69 27.36,9.69 26.9,10.14 20.19,10.14 19.58,9.54 19.58,8.85 19.44,8.71 SOM1.J2.29
  Ground 0.152: v42.44,10.45 40.84,10.45 40.01,11.29 37.64,11.29 37.19,10.83 v34.9,10.83 32.46,8.39 v29.95,8.39
  Bottom 0.152: CAM2.16 40.24,9.84 40.84,10.45 v42.44,10.45
CAM_D6  (via drill 0.38)
  Top 0.152: CAM1.7 37.14,11.39 v37.95,12.2 | v13.72,9.23 13.84,9.11 SOM1.J2.57
  Ground 0.152: v37.95,12.2 37.19,11.44 34.52,11.44 33.76,10.68 28.73,10.68 28.12,11.29 27.36,11.29 26.75,10.68 15.47,10.68 14.02,9.23 v13.72,9.23
  Bottom 0.152: v41.22,11.13 40.93,10.84 CAM2.14 39.66,10.83 38.86,10.83 37.95,11.74 v37.95,12.2
CAM_D7  (via drill 0.38)
  Top 0.152: CAM1.8 37.08,11.79 37.26,11.97 37.26,12.58 37.95,13.27 v37.95,13.73 | SOM1.J2.55 14.24,8.46 14.48,8.7 v14.48,10.75
  Ground 0.152: v41.22,12.51 40.01,13.73 v37.95,13.73 35.97,11.74 33.98,11.74 33.22,10.98 28.96,10.98 28.27,11.67 27.2,11.67 26.52,10.98 14.71,10.98 v14.48,10.75
  Bottom 0.152: CAM2.12 40.41,11.84 41.07,12.51 v41.22,12.51
CAM_HSYNC  (via drill 0.38)
  Top 0.152: CAM1.15 32.47,14.19 v32.92,14.64 | SOM1.J2.63 12.64,8.38 12.95,8.7 v12.95,10.75
  Ground 0.152: v12.95,10.75 17.22,15.02 22.63,15.02 23.01,14.64 v32.92,14.64
  Power 0.152: v41.22,13.88 39.24,15.86 35.36,15.86 34.14,14.64 v32.92,14.64
  Bottom 0.152: CAM2.9 40.69,13.34 v41.22,13.88
CAM_MCLK  (via drill 0.38)
  Top 0.152: SOM1.J2.71 11.04,8.86 v10.67,9.23 | CAM1.16 29.19,13.79 v29.11,13.88
  Ground 0.152: v29.11,13.88 23.16,13.88 22.4,14.64 17.37,14.64 13.64,10.91 13.64,10.53 13.11,9.99 11.43,9.99 v10.67,9.23
  Power 0.152: v29.11,13.88 33.91,13.88 34.52,14.49 39.62,14.49 40.92,13.19 41.53,13.19 42.44,12.28 v42.44,11.82
  Bottom 0.152: CAM2.13 40.44,11.34 40.92,11.82 v42.44,11.82
CAM_PCLK  (via drill 0.38)
  Top 0.152: CAM1.9 35.06,12.19 v34.9,12.35 | SOM1.J2.67 11.84,8.36 11.43,8.77 v11.43,10.75
  Power 0.152: v11.43,10.75 12.42,11.74 31.85,11.74 32.46,12.35 v34.9,12.35
  Bottom 0.152: v41.22,9.76 41.07,9.76 40.65,9.34 CAM2.17 39.64,9.31 39.01,9.31 38.56,9.76 37.03,9.76 34.9,11.9 v34.9,12.35
CAM_SCLK  (via drill 0.38)
  Top 0.152: CAM1.19 29.35,12.59 v29.11,12.35 | SOM1.J2.93 6.64,9.07 v6.48,9.23
  Ground 0.152: v29.11,12.35 29.26,12.2 32.92,12.2 33.98,13.27 35.51,13.27 36.88,14.64 39.09,14.64 40.39,15.94 v42.44,15.94
  Power 0.152: v6.48,9.23 6.48,11.36 7.47,12.35 v29.11,12.35
  Bottom 0.152: CAM2.5 40.4,15.34 41,15.94 v42.44,15.94 42.52,15.94 43.28,16.7 43.28,19.29 42.98,19.59 41.15,19.59 41,19.75 R1.2
CAM_SDATA  (via drill 0.38)
  Top 0.152: CAM1.18 32.79,12.99 v32.92,13.12 | SOM1.J2.91 7.04,8.65 7.24,8.85 v7.24,10.75
  Ground 0.152: v32.92,13.12 34.52,14.72 | 34.52,14.72 37.11,17.31 v42.44,17.31 | v7.24,10.75 8.46,11.97 13.64,11.97 17.14,15.48 33.76,15.48 34.52,14.72
  Bottom 0.152: CAM2.3 40.34,16.34 40.54,16.55 40.54,17 40.84,17.31 v42.44,17.31 41.76,17.31 39.47,19.59 R2.2
CAM_VSYNC  (via drill 0.38)
  Top 0.152: CAM1.14 36.89,14.19 v37.95,15.25 | SOM1.J2.65 12.24,9.18 v12.19,9.23
  Power 0.152: v42.44,14.56 43.05,13.96 43.05,11.52 42.75,11.21 42.14,11.21 41.53,11.82 40.92,11.82 40.54,11.44 34.21,11.44 33.68,10.91 28.5,10.91 28.12,11.29 27.36,11.29 26.98,10.91 15.7,10.91 14.86,10.07 13.03,10.07 v12.19,9.23
  Bottom 0.152: v42.44,14.56 40.84,14.56 40.62,14.34 CAM2.7 38.85,14.34 v37.95,15.25
GND  (via drill 0.38)  (1 unrouted)
  other vias: 8.38,2.68 18.36,13.57
  pour Top: 0,23.17 45.42,23.17 45.34,5.65 45.34,4.89 33.53,4.89 33.53,0.01 0,0.01
  pour Ground: 0,23.17 46.33,23.17 46.33,4.89 33.53,4.89 33.53,0.01 0,0.01
  pour Bottom: 0,23.17 48.16,23.17 48.16,4.89 33.53,4.89 33.53,0.01 0,0.01
MSTR_NRST  (via drill 0.38)
  Top 0.152: 13.94,20.2 14.4,20.2 | 14.4,20.2 15.01,20.2 15.47,20.66 v15.47,21.35 | SW2.2 14.31,20.29 14.4,20.2 | SOM1.J2.92 7.04,5.42 6.74,5.72 4.04,5.72 2.9,6.87 v2.9,21.35
  Power 0.152: v2.9,21.35 v15.47,21.35
  Bottom 0.152: C21.1 15.29,21.52 v15.47,21.35
N$3  (via drill 0.38)
  Top 0.152: v29.34,2.07 30.79,3.51 LED1.C
  Bottom 0.152: v29.34,2.07 30.79,2.07 R9.1
PWRON  (via drill 0.38)
  Top 0.152: SOM1.J1.5 24.24,19.51 23.85,19.9 23.85,20.28 | 23.85,20.28 23.85,20.89 24.31,21.35 v25.76,21.35 | 27.13,20.28 SW1.1 | SW1.2 23.03,20.28 23.85,20.28
  Bottom 0.152: C22.1 33.5,20.58 32.69,20.58 31.93,21.35 v25.76,21.35
SD1_CD  (via drill 0.38)
  Top 0.152: v13.95,2.75 14.64,3.45 SOM1.J2.54
  Bottom 0.152: SDCARD1.CD 16.75,14.16 R8.1 14.71,13.57 15.24,13.04 15.24,4.73 13.95,3.44 v13.95,2.75
SD1_CLK  (via drill 0.38)
  Top 0.152: v18.59,2.75 19.04,3.2 SOM1.J2.32
  Power 0.152: v18.59,2.75 21.79,5.95 v21.79,9.23
  Bottom 0.152: SDCARD1.5 21.72,9.16 v21.79,9.23
SD1_CMD  (via drill 0.38)
  Top 0.152: v17.75,1.23 17.75,3.06 17.04,3.77 SOM1.J2.42
  Power 0.152: v23.24,9.23 23.24,6.18 18.29,1.23 v17.75,1.23
  Bottom 0.152: R3.1 23.92,5.13 SDCARD1.3 23.92,8.55 v23.24,9.23
SD1_DATA0  (via drill 0.38)
  Top 0.152: v15.47,2.75 15.84,3.12 SOM1.J2.48
  Power 0.152: v15.47,2.75 20.34,7.63 v20.34,9.23
  Bottom 0.152: R4.1 20.75,5.12 19.66,5.12 19.52,5.25 SDCARD1.7 19.52,8.4 v20.34,9.23
SD1_DATA1  (via drill 0.38)
  Top 0.152: v16.23,1.23 v16.24,1.24 SOM1.J2.46
  Power 0.152: v16.23,1.23 16,1.23 14.78,2.45 14.78,5.12 v18.9,9.23
  Bottom 0.152: R5.1 19.33,4.3 18.44,5.19 18.44,6.42 SDCARD1.8 18.42,8.75 v18.9,9.23
SD1_DATA2  (via drill 0.38)
  Top 0.152: v16.99,2.75 16.64,3.11 SOM1.J2.44
  Ground 0.152: v16.99,2.75 22.55,8.32 25.22,8.32 v26.14,9.23
  Bottom 0.152: R6.1 26.12,4.32 SDCARD1.1 26.12,9.21 v26.14,9.23
SD1_DATA3  (via drill 0.38)
  Top 0.152: v14.71,1.23 14.78,1.3 14.78,3.06 15.44,3.71 SOM1.J2.50
  Ground 0.152: v14.71,1.23 14.94,1.23 16.38,2.68 16.38,3.06 21.95,8.62 24.08,8.62 v24.69,9.23
  Bottom 0.152: v24.69,9.23 25.02,8.9 SDCARD1.2 25.02,4.71 R7.1
UARTA_CTS  (via drill 0.38)
  Top 0.152: SOM1.J1.68 11.84,14.38 v12.65,13.57 | JP1.6 29.23,18.94 v28.42,19.75
  Ground 0.152: v12.65,13.57 14.71,13.57 20.04,18.91 27.58,18.91 v28.42,19.75
UARTA_RTS
  Top 0.152: SOM1.J1.74 10.64,14.31 10.36,14.03 10.36,13.19 10.82,12.73 24.23,12.73 27.89,16.39 32.08,16.39 33.15,17.46 33.15,18.92 JP1.2
UARTA_RX
  Top 0.152: SOM1.J1.70 11.43,15.72 11.43,16.55 11.73,16.85 31.17,16.85 32.13,17.82 JP1.4
UARTA_TX
  Top 0.152: SOM1.J1.72 11.04,16.7 11.57,17.23 30.86,17.23 31.64,18.01 JP1.5
UARTB_RX  (via drill 0.38)
  Top 0.152: SOM1.J2.41 17.04,8.82 v17.45,9.23
  Power 0.152: v1.14,3.82 1.14,2.45 1.98,1.61 10.74,1.61 17.45,8.32 v17.45,9.23
  Bottom 0.152: IC3.3 1.34,5 1.14,4.81 v1.14,3.82
UARTB_RX_3V3
  Bottom 0.152: JP2.4 9.37,4.33 9.37,5.04 9.22,5.19 6.63,5.19 6.48,5.04 5.77,5.04 IC3.18
UARTB_TX  (via drill 0.38)
  Top 0.152: v16,9.23 16.64,8.59 SOM1.J2.43
  Ground 0.152: v16,9.23 11.2,4.43 5.11,4.43 v3.12,2.45
  Bottom 0.152: IC3.1 3.12,3.94 v3.12,2.45
UARTB_TX_3V3
  Bottom 0.152: JP2.6 8.31,4.33 8.31,3.59 7.01,2.3 4.5,2.3 4.34,2.45 4.34,3.51 4.5,3.67 4.72,3.67 4.72,3.96 IC3.20
USB1_D+
  Top 0.152: SOM1.J2.3 24.64,6.61 24.77,6.49 25.83,6.49 27.13,7.78 28.57,7.78 29.34,7.02 32.31,7.02 33.6,5.72 37.72,5.72 39.09,7.1 39.09,16.93 38.94,17.08 38.41,17.08 38.25,17.23 38.25,17.46 38.41,17.61 38.94,17.61 39.09,17.77 39.09,18.91 JP3.4
USB1_D-
  Top 0.152: SOM1.J2.5 24.24,6.4 24.46,6.18 26.14,6.18 27.36,7.4 28.35,7.4 29.18,6.56 32.16,6.56 33.45,5.27 37.87,5.27 39.57,6.97 JP3.3
USB1_VBUS  (via drill 0.38)
  Top 0.152: SOM1.J2.13 22.63,8.39 22.71,8.47 23.01,8.47 | 23.01,8.47 27.66,8.47 v27.81,8.62 | SOM1.J2.11 23.04,8.44 23.01,8.47 | v27.05,13.12 29.95,16.01 32.46,16.01 36.42,19.97 40.31,19.97 40.57,19.71 JP3.1
  Bottom 0.152: v27.81,8.62 29.03,9.84 29.03,11.13 v27.05,13.12
USER_LED
  Top 0.152: SOM1.J2.58 13.84,3.71 13.03,2.91 13.03,0.85 13.41,0.47 25.69,0.47 LED1.A
USER_SW  (via drill 0.38)
  Top 0.152: v6.93,20.51 6.72,20.29 SW3.2 4.36,20.29 3.35,19.29 3.35,7.1 4.34,6.11 13.87,6.11 14.25,5.72 14.25,4.54 SOM1.J2.56
  Bottom 0.152: C2.1 8.48,20.51 v6.93,20.51
V_BATT  (via drill 0.38)
  Top 0.203: 22.24,14.72 22.64,14.72 SOM1.J1.14 | 22.24,14.72 22.02,14.72 21.84,14.72 | 21.84,14.72 21.44,14.72 SOM1.J1.20 | SOM1.J1.18 21.84,14.72 | SOM1.J1.16 22.24,14.72
  Top 0.254: v22.02,13.88 22.02,14.72
  Bottom 0.152: 3.58,15.83 IC2.1 | 3.58,13.6 IC1.3 3.6,13.97 3.73,14.11 5.26,14.11 5.4,13.97 IC1.4 | 3.58,16.8 IC2.3 3.6,17.17 3.73,17.31 5.26,17.31 5.4,17.17 IC2.4 | 2.79,12.62 2.82,12.58
  Bottom 0.254: C12.2 2.82,13.6 3.58,13.6 | C9.2 2.82,16.8 3.58,16.8 | IC1.1 2.79,12.62 | IC2.1 2.82,15.82
  Bottom 0.305: 10.82,5.34 10.36,5.34 10.36,4.34 JP2.2 10.36,4.33 v10.36,2.68 | 10.82,5.34 10.85,5.31 JP2.1 | 10.82,5.34 12.34,5.34 12.88,4.81 13.7,4.81 C20.1 | 2.82,16.8 2.82,15.82 2.82,13.6 2.82,12.58 2.82,12.13 2.21,11.52 v1.98,11.52
  pour Power: 0,23.17 47.24,23.17 47.24,4.89 33.53,4.89 33.53,0.01 0,0.01
VMMC1  (via drill 0.38)
  Top 0.152: SOM1.J1.3 v24.64,20.33
  Bottom 0.152: 22.33,3.34 22.33,4.73 22.82,5.23 SDCARD1.4 22.86,6.48 22.86,8.24 22.48,8.62 22.48,10.53 | R5.2 R4.2 | R4.2 22.33,3.34 | 22.33,3.34 R3.2 R7.2 R6.2 | C7.1 R8.2 17.88,15.12 22.48,10.53 | C8.1 R4.2 | v24.64,20.33 24.64,12.69 22.48,10.53

### Text on the board
tPlace: Ryan Julian | Biomimetic | Laboratory | Millisystems | 2012.10.22 | GO BEARS! | OMAPProc 2.5 Rev. B